# Altium schematic sheet BLDC_driver_sensorless_logic.SchDoc
size A4
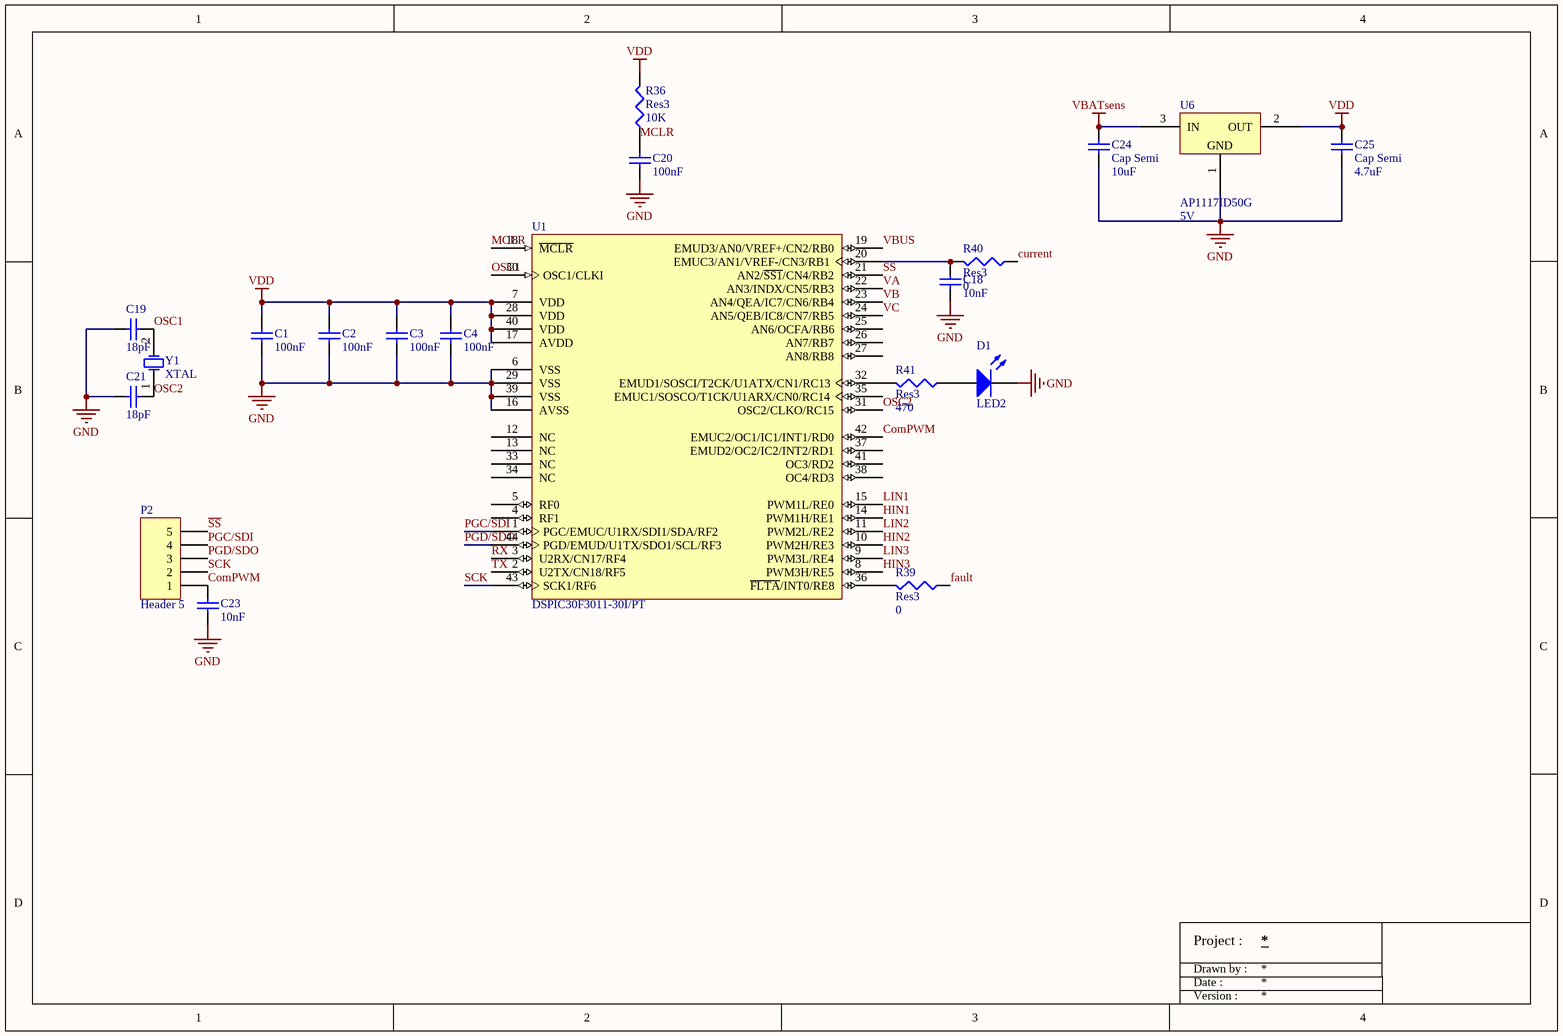
[diagram p0: BLDC_driver_sensorless_logic.SchDoc]

## Parts
C1  value 100nF  [1206 capacitor]  (hidden comment: Cap SMD)
C2  value 100nF  [1206 capacitor]  (hidden comment: Cap SMD)
C3  value 100nF  [1206 capacitor]  (hidden comment: Cap SMD)
C4  value 100nF  [1206 capacitor]  (hidden comment: Cap SMD)
C18  value 10nF  [1206 capacitor]  (hidden comment: Cap SMD)
C19  value 18pF  [1206 capacitor]  (hidden comment: Cap SMD)
C20  value 100nF  [1206 capacitor]  (hidden comment: Cap SMD)
C21  value 18pF  [1206 capacitor]  (hidden comment: Cap SMD)
C23  value 10nF  [1206 capacitor]  (hidden comment: Cap SMD)
C24  Cap Semi  value 10uF  [1206 capacitor]
C25  Cap Semi  value 4.7uF  [1206 capacitor]
D1  LED2  [LED 1206 BLUE]
P2  Header 5  [HDR1X5]
R36  Res3  value 10K  [1206 resistor]
R39  Res3  value 0  [1206 resistor]
R40  Res3  value 0  [1206 resistor]
R41  Res3  value 470  [1206 resistor]
U1  DSPIC30F3011-30I/PT  [TQFP-PT44_N]
U6  AP1117ID50G  value 5V  [TO-252]
Y1  XTAL  [HC49/US]

## Nets
GND: C1.1 C2.1 C3.1 C4.1 C18.1 C19.2 C20.1 C21.2 C23.1 C24.1 C25.1 D1.2(K) U1.6(VSS) U1.16(AVSS) U1.29(VSS) U1.39(VSS) U6.1(GND)
VBATsens: C24.2 U6.3(IN)
VDD: C1.2 C2.2 C3.2 C4.2 C25.2 R36.2 U1.7(VDD) U1.17(AVDD) U1.28(VDD) U1.40(VDD) U6.2(OUT)
ComPWM: C23.2 P2.1 U1.42(EMUC2/OC1/IC1/INT1/RD0)
current: R40.1
fault: R39.1
HIN1: U1.14(PWM1H/RE1)
HIN2: U1.10(PWM2H/RE3)
HIN3: U1.8(PWM3H/RE5)
LIN1: U1.15(PWM1L/RE0)
LIN2: U1.11(PWM2L/RE2)
LIN3: U1.9(PWM3L/RE4)
MCLR: C20.2 R36.1 U1.18(~{MCLR})
OSC1: C19.1 U1.30(OSC1/CLKI) Y1.2(OSC2)
OSC2: C21.1 U1.31(OSC2/CLKO/RC15) Y1.1(OSC1)
PGC/SDI: P2.4 U1.1(PGC/EMUC/U1RX/SDI1/SDA/RF2)
PGD/SDO: P2.3 U1.44(PGD/EMUD/U1TX/SDO1/SCL/RF3)
RX: U1.3(U2RX/CN17/RF4)
~{SS}: P2.5 U1.21(AN2/~{SS1}/CN4/RB2)
SCK: P2.2 U1.43(SCK1/RF6)
TX: U1.2(U2TX/CN18/RF5)
VA: U1.22(AN3/INDX/CN5/RB3)
VB: U1.23(AN4/QEA/IC7/CN6/RB4)
VBUS: U1.19(EMUD3/AN0/VREF+/CN2/RB0)
VC: U1.24(AN5/QEB/IC8/CN7/RB5)
NetC18_2: C18.2 R40.2 U1.20(EMUC3/AN1/VREF-/CN3/RB1)
NetD1_1: D1.1(A) R41.1
NetR39_2: R39.2 U1.36(~{FLTA}/INT0/RE8)
NetR41_2: R41.2 U1.32(EMUD1/SOSCI/T2CK/U1ATX/CN1/RC13)

Not connected (* = marked no-connect by the designer): U1 4(RF1) 5(RF0) 12(NC) 13(NC) 25(AN6/OCFA/RB6) 26(AN7/RB7) 27(AN8/RB8) 33(NC) 34(NC) 35(EMUC1/SOSCO/T1CK/U1ARX/CN0/RC14) 37(EMUD2/OC2/IC2/INT2/RD1) 38(OC4/RD3) 41(OC3/RD2)

## Notes on the sheet
- Drawn by :
- Date :
- Project :
- Version :

## Library data of the parts
C1-C4 C18-C21 C23 = Cap SMD: SMD capacitor
C24 C25 = Cap Semi: Capacitor (Semiconductor SIM Model); Published: 8-Jun-2000; LatestRevisionDate: 29-May-2009; LatestRevisionNote: IPC-7351 Footprint Added.; PackageReference: C1206; Publisher: Altium Limited; PackageDescription: Chip Capacitor
D1 = LED2: Typical RED, GREEN, YELLOW, AMBER GaAs LED; Published: 8-Jun-2000; LatestRevisionDate: 17-Jul-2002; LatestRevisionNote: Re-released for DXP Platform.; PackageVersion: Feb-2002; PackageReference: 3.2X1.6X1.1; Publisher: Altium Limited; PackageDescription: SM LED; 2 Flat Leads
P2 = Header 5: Header, 5-Pin; LatestRevisionDate: 17-Jul-2002; LatestRevisionNote: Re-released for DXP Platform.; Publisher: Altium Limited
R36 R39-R41 = Res3: Resistor; Published: 8-Jun-2000; LatestRevisionDate: 29-May-2009; LatestRevisionNote: IPC-7351 Footprint Added.; PackageReference: J1-0603; Publisher: Altium Limited; PackageDescription: Chip Resistor
U1 = DSPIC30F3011-30I/PT: High-Performance 16-bit Digital Signal Controller, 24 KB Flash, 1 KB SRAM, 1 KB EEPROM, 44-Pin TQFP, Industrial Temperature; FirstPublished: 29-Jan-2009; DatasheetVersion: revE, Apr-2008; PackageVersion: revBB, Aug-2009; PackageReference: TQFP-PT44; Publisher: Altium Limited; PackageDescription: 44-Lead Plastic Thin Quad Flatpack (PT) - 10x10x1mm Body, 2.00mm [TQFP]; Supplier 1: Digi-Key; Supplier Part Number 1: DSPIC30F301130IPT-ND; Supplier 2: Newark; Supplier Part Number 2: 71J3705; Code_JEDEC: MS-026; ComponentLink1Description: Datasheet; ComponentLink1URL: http://ww1.microchip.com/downloads/en/DeviceDoc/70141e.pdf; ComponentLink2Description: Packaging Specification; ComponentLink2URL: http://www.microchip.com/stellent/groups/techpub_sg/documents/packagingspec/en012702.pdf; ComponentLink3Description: Microchip.com Home; ComponentLink3URL: http://www.microchip.com/
U6 = AP1117ID50G: LDO Voltage Regulator; Published: 8-Jun-2000; LatestRevisionDate: 17-Jul-2002; LatestRevisionNote: Re-released for DXP Platform.; PackageReference: RAD-0.3; Publisher: Altium Limited; PackageDescription: Radial Cap, Thru-Hole; 2 Leads; 0.3 in Pin Spacing
Y1 = XTAL: Crystal Oscillator; Published: 8-Jun-2000; LatestRevisionDate: 17-Jul-2002; LatestRevisionNote: Re-released for DXP Platform.; PackageReference: R38; Publisher: Altium Limited; PackageDescription: Crystal, Thru-Hole; 2 Leads; Body 3.1 x 8.2 mm (Dia.xH)